# EAGLE design Control board (EAGLE 5.09)
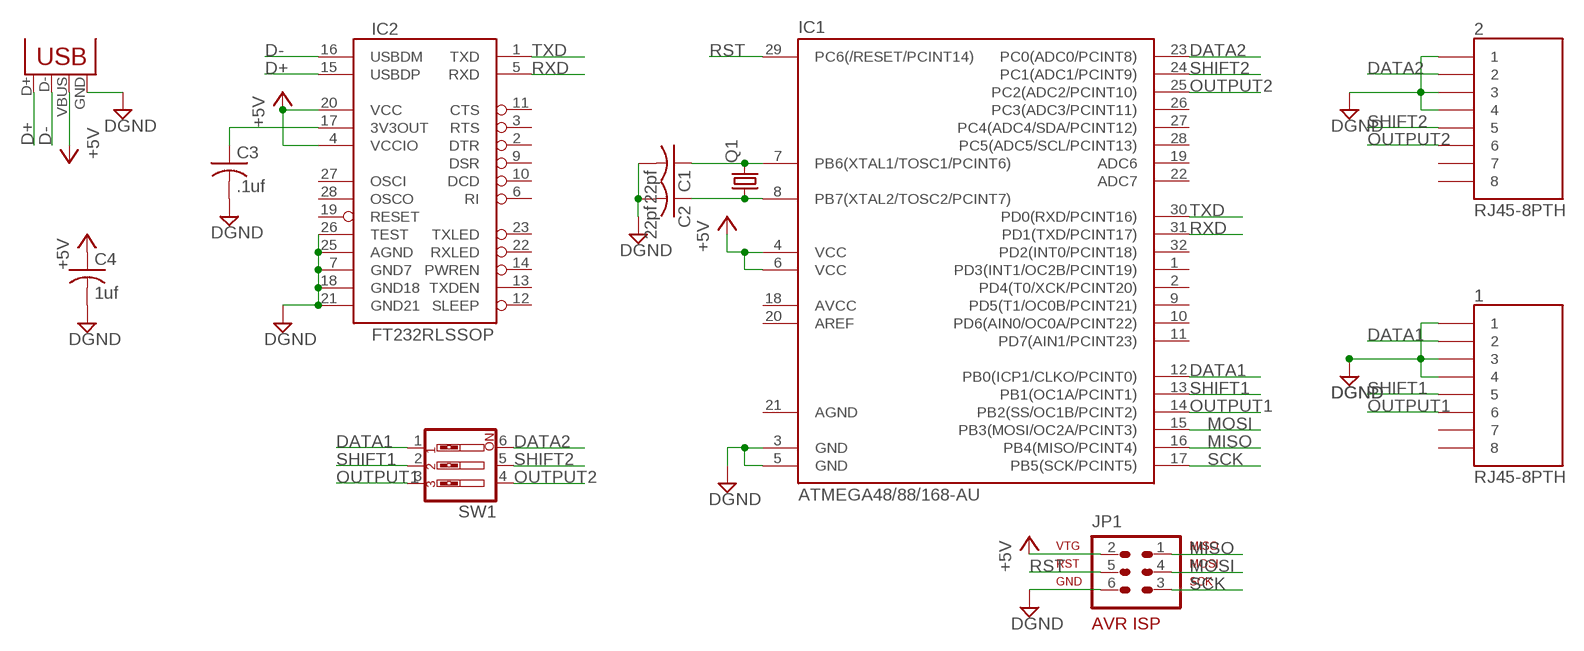
[diagram p0: schematic, sheet 1]

## Parts
1  RJ45-8PTH  [RJ45-8]
2  RJ45-8PTH  [RJ45-8]
C1  22pf  C-US025-025X050  [C025-025X050]
C2  22pf  C-US025-025X050  [C025-025X050]
C3  .1uf  C-USC0603  [C0603]
C4  1uf  C-USC0603  [C0603]
IC1  ATMEGA48/88/168-AU  [TQFP32-08]
IC2  FT232RLSSOP  [SSOP28DB]
JP1  AVR-ISP-6  [AVR-ISP-6]
Q1  CRYSTALHC49S  [HC49/S]
SW1  SW_DIP-3  [EDG-03]
X1  USBPTH  [USB-B-PTH]

## Nets
+5V: C4.1 IC1.4(VCC) IC1.6(VCC) IC2.4(VCCIO) IC2.20(VCC) JP1.2 X1.VBUS
D+: IC2.15(USBDP) X1.D+
D-: IC2.16(USBDM) X1.D-
DATA1: 1.2 IC1.12(PB0(ICP1/CLKO/PCINT0)) SW1.1
DATA2: 2.2 IC1.23(PC0(ADC0/PCINT8)) SW1.6
DGND: 1.1 1.3 1.4 2.1 2.3 2.4 C1.2 C2.2 C3.2 C4.2 IC1.3(GND) IC1.5(GND) IC2.7(GND7) IC2.18(GND18) IC2.21(GND21) IC2.25(AGND) IC2.26(TEST) JP1.6 X1.GND
MISO: IC1.16(PB4(MISO/PCINT4)) JP1.1
MOSI: IC1.15(PB3(MOSI/OC2A/PCINT3)) JP1.4
N$3: C2.1 IC1.8(PB7(XTAL2/TOSC2/PCINT7)) Q1.1
N$4: C1.1 IC1.7(PB6(XTAL1/TOSC1/PCINT6)) Q1.2
N$6: C3.1 IC2.17(3V3OUT)
OUTPUT1: 1.6 IC1.14(PB2(SS/OC1B/PCINT2)) SW1.3
OUTPUT2: 2.6 IC1.25(PC2(ADC2/PCINT10)) SW1.4
RST: IC1.29(PC6(/RESET/PCINT14)) JP1.5
RXD: IC1.31(PD1(TXD/PCINT17)) IC2.5(RXD)
SCK: IC1.17(PB5(SCK/PCINT5)) JP1.3
SHIFT1: 1.5 IC1.13(PB1(OC1A/PCINT1)) SW1.2
SHIFT2: 2.5 IC1.24(PC1(ADC1/PCINT9)) SW1.5
TXD: IC1.30(PD0(RXD/PCINT16)) IC2.1(TXD)
Unconnected: 1.7 1.8 2.7 2.8 IC1.1(PD3(INT1/OC2B/PCINT19)) IC1.2(PD4(T0/XCK/PCINT20)) IC1.9(PD5(T1/OC0B/PCINT21)) IC1.10(PD6(AIN0/OC0A/PCINT22)) IC1.11(PD7(AIN1/PCINT23)) IC1.18(AVCC) IC1.19(ADC6) IC1.20(AREF) IC1.22(ADC7) IC1.26(PC3(ADC3/PCINT11)) IC1.27(PC4(ADC4/SDA/PCINT12)) IC1.28(PC5(ADC5/SCL/PCINT13)) IC1.32(PD2(INT0/PCINT18)) IC2.2(DTR) IC2.3(RTS) IC2.6(RI) IC2.9(DSR) IC2.10(DCD) IC2.11(CTS) IC2.12(SLEEP) IC2.13(TXDEN) IC2.14(PWREN) IC2.19(RESET) IC2.22(RXLED) IC2.23(TXLED) IC2.27(OSCI) IC2.28(OSCO)

## Power pins joined to a net without a drawn wire
AGND: IC1.21(AGND)

## Library data of the parts
1 2 = SparkFun:RJ45-8: RJ45 Jack Simple RJ45, 8-pin connection - connector for common Cat5, Cat5e, and Cat6 Ethernet cables. Footprint not yet proven in production. Connector sku is PRT-00643; Breakout PCB sku is BOB-00716.
C1-C4 = resistor:C-US: CAPACITOR, American symbol
IC1 = atmega8:ATMEGA48/88/168
IC2 = SparkFun:FT232RL: USB UART FT232RL 4th Generation USB UART (USB <-> Serial) Controller. Spark Fun Electronics SKU : COM-00650
JP1 = avr-6:AVR-ISP-6: AVR ISP-6 Serial Programming Header
Q1 = crystal:CRYSTAL: CRYSTAL
SW1 = special:SW_DIP-3: DIP SWITCH
X1 = SparkFun:USB: USB Connectors USB-B-PTH is fully proven SKU : PRT-00139 USB-miniB is fully proven SKU : PRT-00587 USB-A-PCB is untested. USB-A-H is throughly reviewed, but untested. Spark Fun Electronics SKU : PRT-00437 USB-B-SMT is throughly reviewed, but untested. Needs silkscreen touching up. USB-A-S has not been used/tested USB-MB-H has not been used/tested

## Board
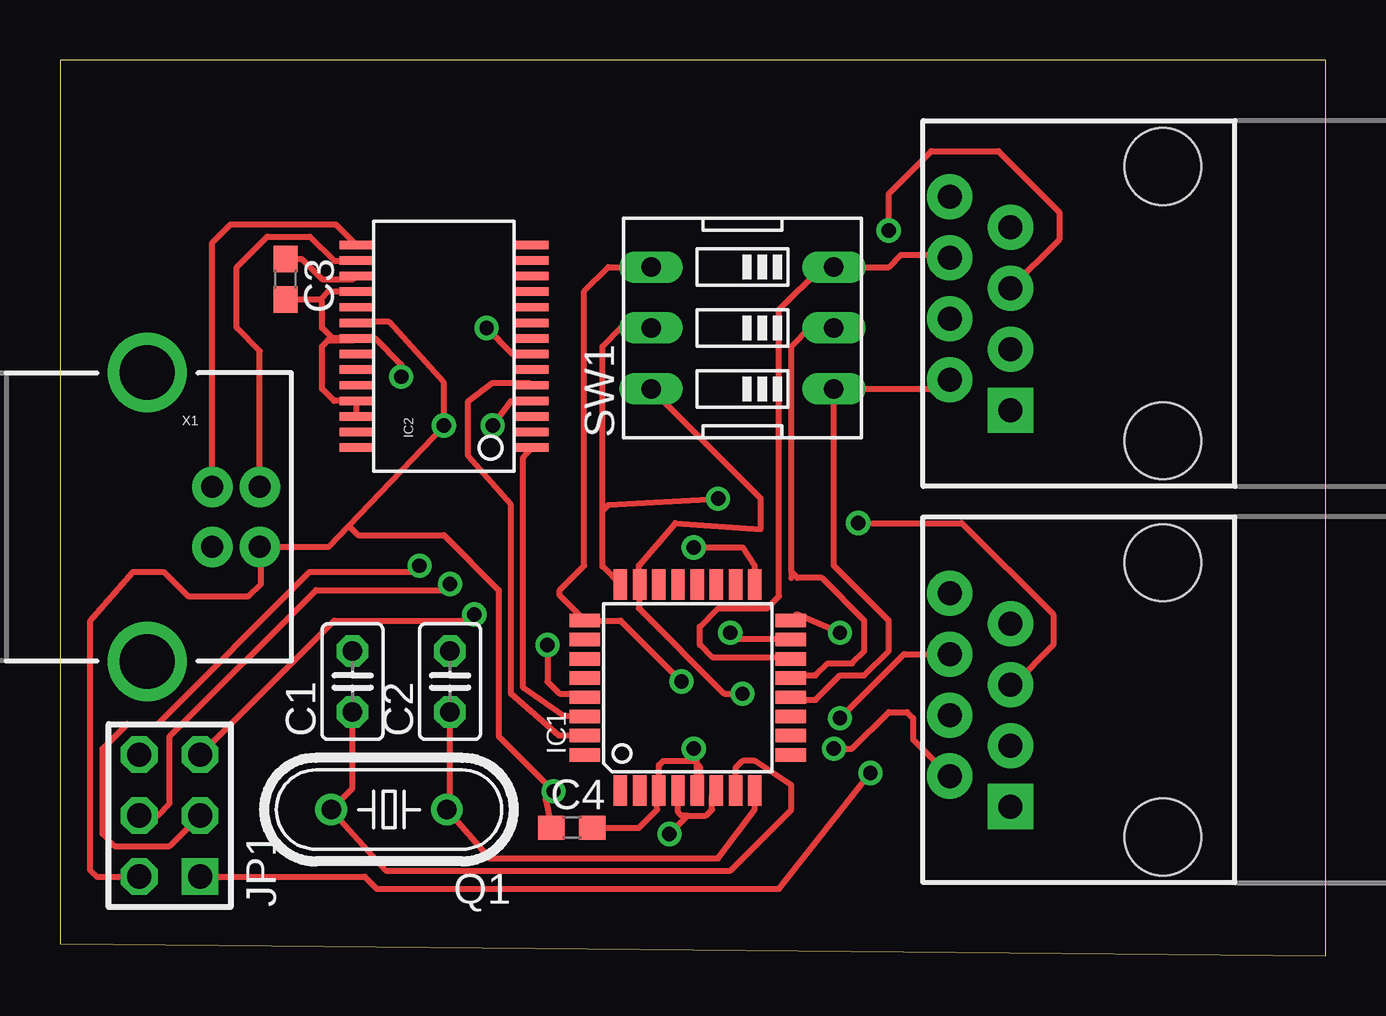
[diagram p1: board, top side]
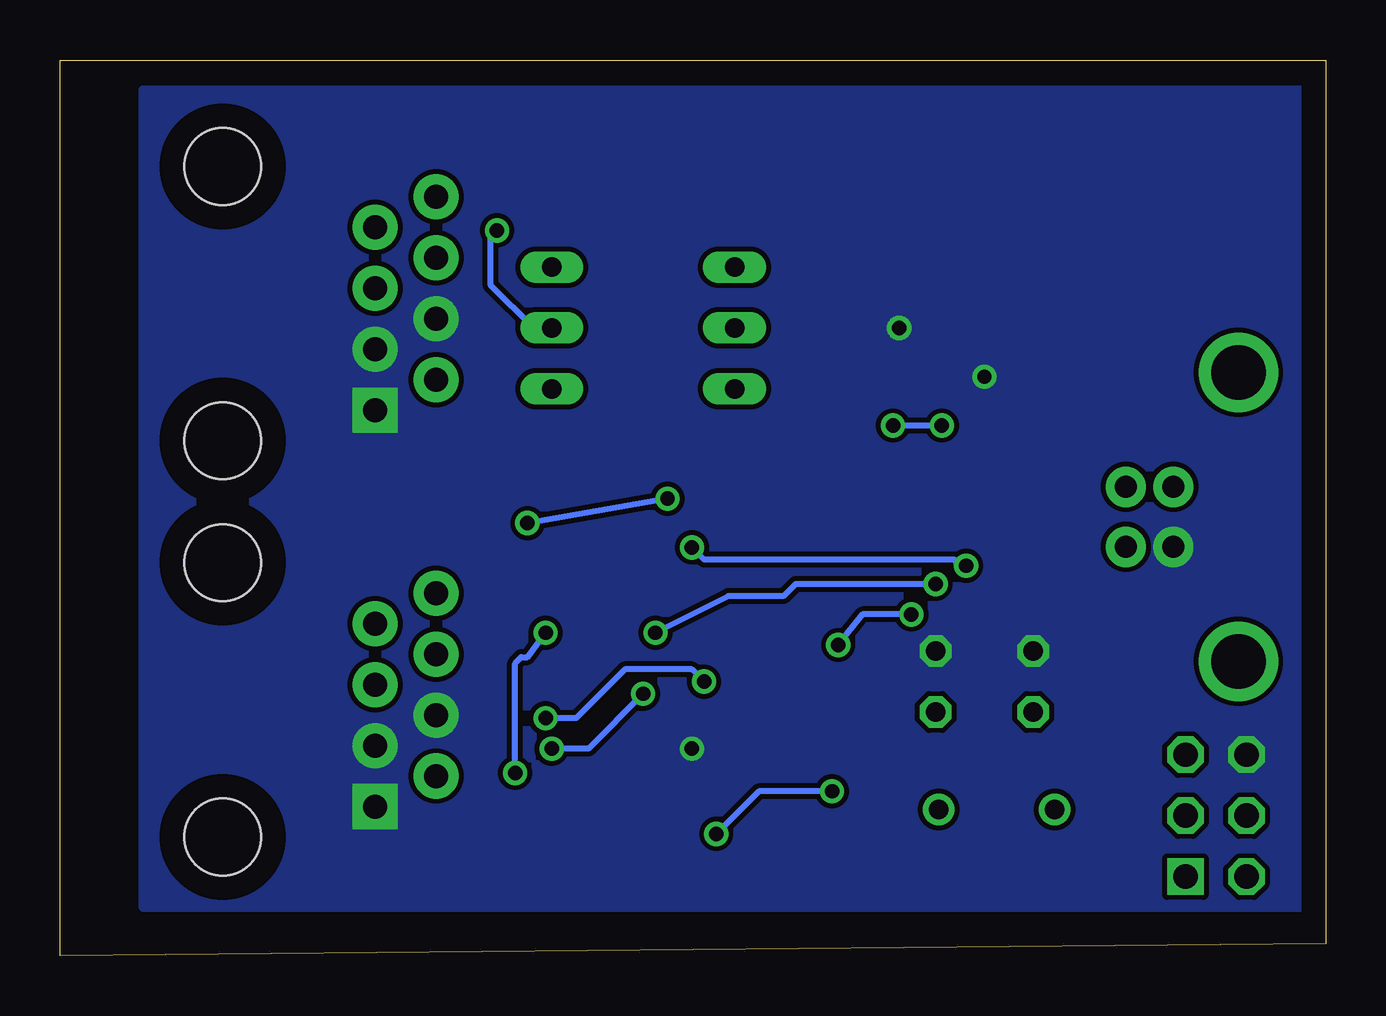
[diagram p2: board, bottom side, seen from below]

Size 52.76 x 37.33 mm. Coordinates in mm from the lower left corner, seen from the top.
Outline: 0,0.51 52.76,0 52.76,37.33 0,37.33 0,0.51
Copper layers (1*16): Top 0.035mm / dielectric 1.5mm / Bottom 0.035mm
Design rules "default *": minimum track width 10mil, minimum drill 23mil, track to track 8mil, track to pad 8mil, pad to pad 8mil, via to via 8mil, smd to smd 8mil, copper to edge 40mil, drill to drill 8mil, minimum pad ring 10mil, minimum via ring 8mil, stop-mask expansion 4mil, vias tented up to drill 0mil, thermal gap 10mil

### Footprints (pad centres in the part's own frame; a part is rotated, then mirrored left to right if it is on the bottom)
RJ45-8 = drill 1 pad 1.88 square: 1 -4.445,6.35 | drill 1 pad 1.88 round: 2 -3.175,8.89; 3 -1.905,6.35; 4 -0.635,8.89; 5 0.635,6.35; 6 1.905,8.89; 7 3.175,6.35; 8 4.445,8.89 | hole 3.2: -5.715,0; 5.715,0
C025-025X050 = drill 0.813 octagon: 1 -1.27,0; 2 1.27,0
C0603 = smd 1.1 x 1: 1 -0.85,0; 2 0.85,0
TQFP32-08 = smd 1.27 x 0.559: 1 -4.293,2.8; 2 -4.293,2; 3 -4.293,1.2; 4 -4.293,0.4; 5 -4.293,-0.4; 6 -4.293,-1.2; 7 -4.293,-2; 8 -4.293,-2.8; 17 4.293,-2.8; 18 4.293,-2; 19 4.293,-1.2; 20 4.293,-0.4; 21 4.293,0.4; 22 4.293,1.2; 23 4.293,2; 24 4.293,2.8 | smd 0.559 x 1.27: 9 -2.8,-4.293; 10 -2,-4.293; 11 -1.2,-4.293; 12 -0.4,-4.293; 13 0.4,-4.293; 14 1.2,-4.293; 15 2,-4.293; 16 2.8,-4.293; 25 2.8,4.293; 26 2,4.293; 27 1.2,4.293; 28 0.4,4.293; 29 -0.4,4.293; 30 -1.2,4.293; 31 -2,4.293; 32 -2.8,4.293
SSOP28DB = smd 0.348 x 1.397: 1 -4.225,-3.656; 2 -3.575,-3.656; 3 -2.925,-3.656; 4 -2.275,-3.656; 5 -1.625,-3.656; 6 -0.975,-3.656; 7 -0.325,-3.656; 8 0.325,-3.656; 9 0.975,-3.656; 10 1.625,-3.656; 11 2.275,-3.656; 12 2.925,-3.656; 13 3.575,-3.656; 14 4.225,-3.656; 15 4.225,3.656; 16 3.575,3.656; 17 2.925,3.656; 18 2.275,3.656; 19 1.625,3.656; 20 0.975,3.656; 21 0.325,3.656; 22 -0.325,3.656; 23 -0.975,3.656; 24 -1.625,3.656; 25 -2.275,3.656; 26 -2.925,3.656; 27 -3.575,3.656; 28 -4.225,3.656
AVR-ISP-6 = drill 1.016 square: 1 -2.54,-1.27 | drill 1.016 octagon: 2 -2.54,1.27; 3 0,-1.27; 4 0,1.27; 5 2.54,-1.27; 6 2.54,1.27
HC49/S = drill 0.813 round: 1 -2.413,0; 2 2.413,0
EDG-03 = drill 0.813 long: 1 -2.54,-3.81; 2 0,-3.81; 3 2.54,-3.81; 4 2.54,3.81; 5 0,3.81; 6 -2.54,3.81
USB-B-PTH = drill 0.914 pad 1.676 round: D+ 0,1.25; D- 1.981,1.25; GND 0,-1.25; VBUS 1.981,-1.25 | drill 2.286 round: P$1 -2.718,-6.02; P$2 -2.718,6.02

### Placement (x,y rotation side)
1  45.97,27.18 90 top
2  45.97,10.67 90 top
C1  12.19,11.43 90 top
C2  16.26,11.43 90 top
C3  9.4,28.19 270 top
C4  21.34,5.33 0 top
IC1  26.16,11.18 90 top
IC2  16,25.4 90 top
JP1  4.57,5.84 90 top
Q1  13.72,6.1 180 top
SW1  28.45,26.16 90 top
X1  6.35,18.29 0 top

### Tracks (layer width: path | path; a pad name or v marks a point on that pad's centre or on a via)
+5V  (via drill 0.6)
  Top 0.254: IC1.4 25.76,5.99 25.91,5.84 26.16,5.84 | 26.16,5.84 26.92,5.84 27.18,6.1 27.18,6.7 IC1.6 | 12.03,17.92 11.2,17.04 X1.VBUS 8.38,16.99 8.38,15.49 7.87,14.99 5.33,14.99 4.32,16 3.05,16 1.27,13.97 1.27,3.56 1.52,3.3 JP1.2 | 12.03,17.92 v16,22.1 16,23.88 13.72,26.42 12.39,26.42 IC2.20 | v18.03,22.1 18.8,23.11 19.65,23.11 IC2.4 | C4.1 20.23,6.52 v20.57,6.86 18.29,9.14 18.29,15.24 16,17.53 12.43,17.53 12.03,17.92 | v25.4,5.08 26.16,5.84
  Bottom 0.254: v16,22.1 v18.03,22.1 | v20.57,6.86 23.62,6.86 v25.4,5.08
D+
  Top 0.254: X1.D+ 6.35,29.72 7.11,30.48 11.49,30.48 IC2.15
D-
  Top 0.254: X1.D- 8.33,25.2 7.37,26.16 7.37,28.7 8.64,29.97 10.41,29.97 11.43,28.96 12.33,28.96 IC2.16
DATA1
  Top 0.254: IC1.12 30.56,10.67 31.5,10.67 32.51,11.68 33.53,11.68 34.54,12.7 34.54,13.97 32.26,16.26 SW1.1 36.7,23.62 1.2
DATA2  (via drill 0.6)
  Top 0.254: v28.45,10.92 27.69,10.92 24.13,14.48 24.13,15.44 IC1.23 24.13,15.5 24.13,16.26 25.65,18.03 29.21,17.78 29.21,19.05 SW1.6 | v32.26,8.64 33.02,8.64 34.54,10.16 35.31,10.16 35.56,9.91 35.56,9.02 2.2
  Bottom 0.254: v32.26,8.64 30.73,8.64 v28.45,10.92
DGND  (via drill 0.6)
  Top 0.254: v26.42,8.64 26.56,8.49 IC1.5 26.67,6.99 26.67,7.87 26.42,8.13 25.15,8.13 24.96,7.94 IC1.3 24.89,6.81 24.89,6.1 24.13,5.33 C4.2 | 10.83,27.34 C3.2 | 10.83,27.34 11.18,27.69 12.34,27.69 IC2.18 | IC2.26 IC2.25 11.42,23.12 10.92,23.62 10.92,25.4 11.18,25.65 12.28,25.65 IC2.21 | IC2.21 11.36,25.72 10.92,26.16 10.92,27.26 10.83,27.34 | IC2.7 18.87,25.07 v17.78,26.16 | IC2.21 13.14,25.72 14.22,24.64 v14.22,24.13
  pour Bottom (no thermals): 1.02,36.07 1.02,2.03 49.28,2.03 49.28,36.07
MISO  (via drill 0.6)
  Top 0.254: JP1.1 12.7,3.3 13.21,2.79 29.97,2.79 v33.78,7.62 | v32.51,13.46 30.7,14.22 IC1.16
  Bottom 0.254: v33.78,7.62 33.78,12.19 33.53,12.45 33.27,12.45 v32.51,13.46
MOSI  (via drill 0.6)
  Top 0.254: v16.26,15.49 16,15.24 10.67,15.24 4.57,9.14 4.57,6.35 4.06,5.84 JP1.4 | v27.94,13.46 28.19,13.21 30.42,13.21 IC1.15
  Bottom 0.254: v27.94,13.46 24.89,14.99 22.61,14.99 22.1,15.49 v16.26,15.49
N$3
  Top 0.254: C2.1 16.26,6.22 Q1.1 17.91,4.06 27.43,4.06 28.96,6.1 IC1.8
N$4
  Top 0.254: C1.1 12.19,6.99 Q1.2 13.59,3.56 27.94,3.56 30.48,6.1 30.48,7.11 28.96,8.13 28.45,8.13 28.16,7.84 IC1.7
N$6
  Top 0.254: C3.1 10.07,29.04 10.92,28.19 12.21,28.19 IC2.17
OUTPUT1
  Top 0.254: 1.6 36.96,29.21 35.05,29.21 34.54,28.7 SW1.3 31.75,28.7 29.97,26.92 29.97,14.99 29.46,14.48 27.43,14.48 26.67,13.72 26.67,12.95 27.18,12.45 30.39,12.45 IC1.14
OUTPUT2  (via drill 0.6)
  Top 0.254: SW1.4 22.86,28.7 21.84,27.69 21.84,16.26 20.83,15.24 20.83,15.02 IC1.25 23.37,13.97 v25.91,11.43 | 2.6 35.18,12.57 v32.51,9.91
  Bottom 0.254: v32.51,9.91 31.24,9.91 29.21,11.94 26.42,11.94 v25.91,11.43
RST  (via drill 0.6)
  Top 0.254: IC1.29 21.72,10.92 20.83,10.92 20.32,11.43 v20.32,12.95 | JP1.5 11.43,13.97 17.02,13.97 v17.27,14.22
  Bottom 0.254: v17.27,14.22 19.3,14.22 v20.32,12.95
RXD
  Top 0.254: IC1.31 20.8,9.18 18.8,10.92 18.8,18.8 17.02,20.83 17.02,23.11 18.03,23.88 19.56,23.88 IC2.5
SCK  (via drill 0.6)
  Top 0.254: JP1.3 4.57,4.57 2.29,4.57 1.78,5.08 1.78,8.64 2.79,9.65 4.06,9.65 10.41,16 14.73,16 v14.99,16.26 | v26.42,17.02 28.45,17.02 28.96,16.26 IC1.17
  Bottom 0.254: v14.99,16.26 15.24,16.26 15.49,16.51 25.91,16.51 v26.42,17.02
SHIFT1  (via drill 0.6)
  Top 0.254: SW1.2 31.24,26.16 30.48,25.4 30.48,16 | 30.48,16 30.48,15.75 | IC1.13 30.56,11.68 31.5,11.68 32,12.19 33.02,12.19 33.53,12.7 33.53,13.97 31.75,15.75 30.73,15.75 30.48,16 | v34.54,30.23 34.54,31.75 36.32,33.53 39.12,33.53 41.66,30.99 41.66,29.84 1.5
  Bottom 0.254: SW1.2 33.02,26.16 34.8,27.94 34.8,29.97 v34.54,30.23
SHIFT2  (via drill 0.6)
  Top 0.254: SW1.5 23.37,26.16 22.61,25.4 22.61,18.54 | 22.61,18.54 22.61,16.23 IC1.24 | 2.5 39.75,11.3 41.4,12.95 41.4,14.22 37.59,18.03 v33.27,18.03 | v27.43,19.05 22.86,18.8 22.61,18.54
  Bottom 0.254: v27.43,19.05 v33.27,18.03
TXD
  Top 0.254: IC1.30 21.01,9.98 19.3,11.18 19.3,20.77 IC2.1